# EAGLE design ccd_driver (EAGLE 8.1.0)
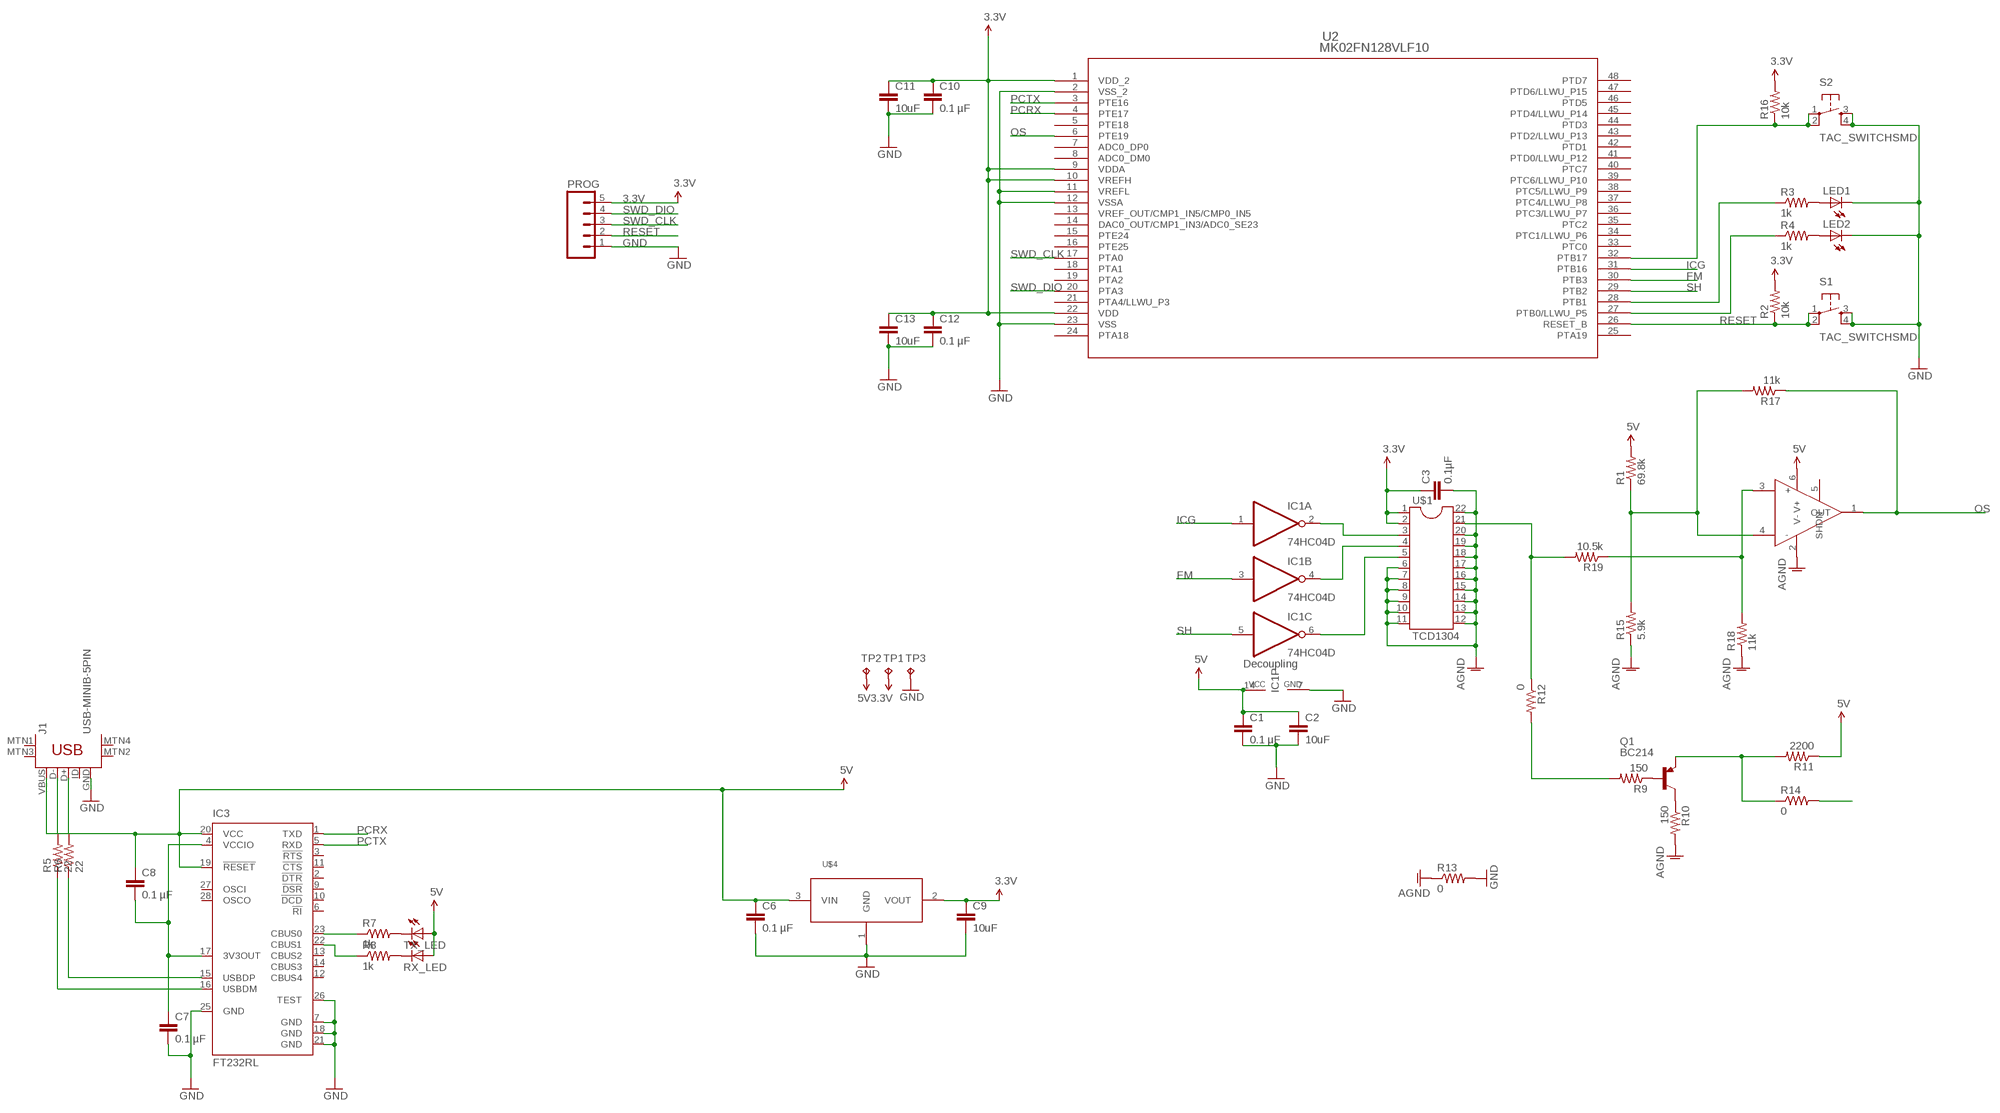
[diagram p0: schematic, sheet 1]

## Parts
C1  0.1 µF  C-EUC1206  [C1206]
C2  10uF  C-EUC1206  [C1206]
C3  0.1µF  C-EUC1206  [C1206]
C6  0.1 µF  C-EUC1206  [C1206]
C7  0.1 µF  C-EUC1206  [C1206]
C8  0.1 µF  C-EUC1206  [C1206]
C9  10uF  C-EUC1206  [C1206]
C10  0.1 µF  C-EUC1206  [C1206]
C11  10uF  C-EUC1206  [C1206]
C12  0.1 µF  C-EUC1206  [C1206]
C13  10uF  C-EUC1206  [C1206]
IC1  74HC04D  [SO14]
IC3  FT232RL  [SSOP28]
J1  USB-MINIB-5PIN  [USB-MINIB]
LED1  LEDCHIPLED_0805  [CHIPLED_0805]
LED2  LEDCHIPLED_0805  [CHIPLED_0805]
PROG  M05LOCK  [1X05_LOCK]
Q1  BC214  [TO92]
R1  69.8k  R-US_R0805  [R0805]
R2  10k  R-US_R0805  [R0805]
R3  1k  R-US_R0805  [R0805]
R4  1k  R-US_R0805  [R0805]
R5  22  R-US_R0805  [R0805]
R6  22  R-US_R0805  [R0805]
R7  1k  R-US_R0805  [R0805]
R8  1k  R-US_R0805  [R0805]
R9  150  R-US_R0805  [R0805]
R10  150  R-US_R0805  [R0805]
R11  2200  R-US_R0805  [R0805]
R12  0  R-US_R0805  [R0805]
R13  0  R-US_R0805  [R0805]
R14  0  R-US_R0805  [R0805]
R15  5.9k  R-US_R0805  [R0805]
R16  10k  R-US_R0805  [R0805]
R17  11k  R-US_R0805  [R0805]
R18  11k  R-US_R0805  [R0805]
R19  10.5k  R-US_R0805  [R0805]
RX_LED  LEDCHIPLED_0805  [CHIPLED_0805]
S1  TAC_SWITCHSMD  [TACTILE-SWITCH-SMD]
S2  TAC_SWITCHSMD  [TACTILE-SWITCH-SMD]
TP1  TPPAD1-17Y  [P1-17Y]
TP2  TPPAD1-17Y  [P1-17Y]
TP3  TPPAD1-17Y  [P1-17Y]
TX_LED  LEDCHIPLED_0805  [CHIPLED_0805]
U2  MK02FN128VLF10  [LQFP-48_7X7X1.6]
U$1  TCD1304  [TCD1304]
U$3  LTC6252  [TSOT23-6]
U$4  LD1117V33  [TO220H]

## Nets
3.3V: C3.1 C9.1 C10.1 C11.1 C12.1 C13.1 PROG.5 R2.2 R16.2 TP1.TP U2.1(VDD_2) U2.9(VDDA) U2.10(VREFH) U2.22(VDD) U$1.1 U$1.2 U$4.2(VOUT)
5V: C1.1 C2.1 C6.1 C8.1 IC1.14(P:VCC) IC3.19(!RESET) IC3.20(VCC) J1.VBUS R1.2 R11.1 RX_LED.A TP2.TP TX_LED.A U$3.6(V+) U$4.3(VIN)
AGND: C3.2 R10.2 R13.1 R15.1 R18.1 U$1.6 U$1.7 U$1.8 U$1.9 U$1.10 U$1.11 U$1.12 U$1.13 U$1.14 U$1.15 U$1.16 U$1.17 U$1.18 U$1.19 U$1.20 U$1.22 U$3.2(V-)
BU: Q1.1(E) R11.2 R14.1
FM: IC1.3(B:I) U2.30(PTB3)
GND: C1.2 C2.2 C6.2 C7.2 C9.2 C10.2 C11.2 C12.2 C13.2 IC1.7(P:GND) IC3.7(GND) IC3.18(GND) IC3.21(GND) IC3.25(GND) IC3.26(TEST) J1.GND LED1.C LED2.C PROG.1 R13.2 S1.3 S1.4 S2.3 S2.4 TP3.TP U2.2(VSS_2) U2.11(VREFL) U2.12(VSSA) U2.23(VSS) U$4.1(GND)
ICG: IC1.1(A:I) U2.31(PTB16)
N$1: R18.2 R19.1 U$3.3(+)
N$2: IC1.2(A:O) U$1.3
N$3: IC1.4(B:O) U$1.4
N$4: IC1.6(C:O) U$1.5
N$5: Q1.2(B) R9.1
N$7: R16.1 S2.1 S2.2 U2.32(PTB17)
N$8: R1.1 R15.2 R17.2 U$3.4(-)
N$9: Q1.3(C) R10.1
N$10: R12.1 R19.2 U$1.21
N$11: R3.1 U2.28(PTB1)
N$12: LED1.A R3.2
N$13: LED2.A R4.2
N$14: J1.D- R5.2
N$15: R4.1 U2.27(PTB0/LLWU_P5)
N$16: J1.D+ R6.2
N$17: C7.1 C8.2 IC3.4(VCCIO) IC3.17(3V3OUT)
N$18: IC3.23(CBUS0) R7.1
N$19: IC3.16(USBDM) R5.1
N$20: IC3.15(USBDP) R6.1
N$21: IC3.22(CBUS1) R8.1
N$22: R8.2 RX_LED.C
N$23: R7.2 TX_LED.C
N$24: R9.2 R12.2
OS: R14.2 R17.1 U2.6(PTE19) U$3.1(OUT)
PCRX: IC3.1(TXD) U2.4(PTE17)
PCTX: IC3.5(RXD) U2.3(PTE16)
RESET: PROG.2 R2.1 S1.1 S1.2 U2.26(RESET_B)
SH: IC1.5(C:I) U2.29(PTB2)
SWD_CLK [data]: PROG.3 U2.17(PTA0)
SWD_DIO [data]: PROG.4 U2.20(PTA3)
Unconnected: IC1.8(D:O) IC1.9(D:I) IC1.10(E:O) IC1.11(E:I) IC1.12(F:O) IC1.13(F:I) IC3.2(!DTR) IC3.3(!RTS) IC3.6(!RI) IC3.9(!DSR) IC3.10(!DCD) IC3.11(!CTS) IC3.12(CBUS4) IC3.13(CBUS2) IC3.14(CBUS3) IC3.27(OSCI) IC3.28(OSCO) J1.ID J1.MTN1(MTN2) J1.MTN2(MTN3) J1.MTN3(MTN1) J1.MTN4 U2.5(PTE18) U2.7(ADC0_DP0) U2.8(ADC0_DM0) U2.13(VREF_OUT/CMP1_IN5/CMP0_IN5) U2.14(DAC0_OUT/CMP1_IN3/ADC0_SE23) U2.15(PTE24) U2.16(PTE25) U2.18(PTA1) U2.19(PTA2) U2.21(PTA4/LLWU_P3) U2.24(PTA18) U2.25(PTA19) U2.33(PTC0) U2.34(PTC1/LLWU_P6) U2.35(PTC2) U2.36(PTC3/LLWU_P7) U2.37(PTC4/LLWU_P8) U2.38(PTC5/LLWU_P9) U2.39(PTC6/LLWU_P10) U2.40(PTC7) U2.41(PTD0/LLWU_P12) U2.42(PTD1) U2.43(PTD2/LLWU_P13) U2.44(PTD3) U2.45(PTD4/LLWU_P14) U2.46(PTD5) U2.47(PTD6/LLWU_P15) U2.48(PTD7) U$3.5(SHDN)

## Notes on the sheet
- Decoupling

## Library data of the parts
C1-C3 C6-C13 = resistor:C-EU: CAPACITOR, European symbol
IC1 = 74xx-eu:74*04: Hex INVERTER
IC3 = ftdichip:FT232R: Source: http://www.ftdichip.com/Documents/DataSheets/DS_FT232R_v104.pdf; MPN: FT232RL; OC_FARNELL: 1146032; OC_NEWARK: 91K9918
J1 = SparkFun-Connectors:USB-MINIB: Mini-USB "B" connector with 5th pin broken out. Created new symbol breaking out 5th "ID" pin in mini/micro USB connector spec. See: http://en.wikipedia.org/wiki/Mini_usb#Cables. Uses same footprint as 4-pin symbol. Also added pins to connect to mounting / shield pads if required (probably not generally needed as signals aren't shielded once they leave the connector).; PROD_ID: CONN-08193
LED1 LED2 RX_LED TX_LED = led:LED: LED OSRAM: - CHIPLED LG R971, LG N971, LY N971, LG Q971, LY Q971, LO R971, LY R971 LH N974, LH R974 LS Q976, LO Q976, LY Q976 LO Q996 - Hyper CHIPLED LW Q18S LB Q993, LB Q99A, LB R99A - SideLED LS A670, LO A670, LY A670, LG A670, LP A670 LB A673, LV A673, LT A673, LW A673 LH A674 LY A675 LS A676, LA A676, LO A676, LY A676, LW A676 LS A679, LY A679, LG A679 - Hyper Micro SIDELED® LS Y876, LA Y876, LO Y876, LY Y876 LT Y87S - SmartLED LW L88C, LW L88S LB L89C, LB L89S, LG L890 LS L89K, LO L89K, LY L89K LS L896, LA L896, LO L896, LY L896 - TOPLED LS T670, LO T670, LY T670, LG T670, LP T670 LSG T670, LSP T670, LSY T670, LOP T670, LYG T670 LG T671, LOG T671, LSG T671 LB T673, LV T673, LT T673, LW T673 LH T674 LS T676, LA T676, LO T676, LY T676, LB T676, LH T676, LSB T676, LW T676 LB T67C, LV T67C, LT T67C, LS T67K, LO T67K, LY T67K, LW E67C LS E67B, LA E67B, LO E67B, LY E67B, LB E67C, LV E67C, LT E67C LW T67C LS T679, LY T679, LG T679 LS T770, LO T770, LY T770, LG T770, LP T770 LB T773, LV T773, LT T773, LW T773 LH T774 LS E675, LA E675, LY E675, LS T675 LS T776, LA T776, LO T776, LY T776, LB T776 LHGB T686 LT T68C, LB T68C - Hyper Mini TOPLED® LB M676 - Mini TOPLED Santana® LG M470 LS M47K, LO M47K, LY M47K Source: http://www.osram.convergy.de LUXEON: - LUMILED® LXK2-PW12-R00, LXK2-PW12-S00, LXK2-PW14-U00, LXK2-PW14-V00 LXK2-PM12-R00, LXK2-PM12-S00, LXK2-PM14-U00 LXK2-PE12-Q00, LXK2-PE12-R00, LXK2-PE12-S00, LXK2-PE14-T00, LXK2-PE14-U00 LXK2-PB12-K00, LXK2-PB12-L00, LXK2-PB12-M00, LXK2-PB14-N00, LXK2-PB14-P00, LXK2-PB14-Q00 LXK2-PR12-L00, LXK2-PR12-M00, LXK2-PR14-Q00, LXK2-PR14-R00 LXK2-PD12-Q00, LXK2-PD12-R00, LXK2-PD12-S00 LXK2-PH12-R00, LXK2-PH12-S00 LXK2-PL12-P00, LXK2-PL12-Q00, LXK2-PL12-R00 Source: www.luxeon.com KINGBRIGHT: KA-3528ASYC Source: www.kingbright.com
PROG = SparkFun-Connectors:M05: Header 5 Standard 5-pin 0.1" header. Use with straight break away headers (SKU : PRT-00116), right angle break away headers (PRT-00553), swiss pins (PRT-00743), machine pins (PRT-00117), and female headers (PRT-00115). Molex polarized connector foot print use with SKU : PRT-08230 with associated crimp pins and housings.
Q1 = transistor-pnp:BC214: PNP Transistor
R1-R19 = resistor:R-US_: RESISTOR, American symbol
S1 S2 = SparkFun-Retired:TAC_SWITCH: Momentary Switch Button commonly used for reset or general input. Spark Fun Electronics SKU : COM-00097 SMT- SWCH-08247; PROD_ID: SWCH-08247
TP1-TP3 = testpad:TP: Test pad
U2 = MK02FN128VLF10:MK02FN128VLF10; CPU: ARM Cortex-M4F; FLASHKB: 128; MANUFACTURER_PART_NUMBER: mk02fn128vlf10; MAXFREQUENCY: 100; PINCOUNT: 48; SRAMKB: 16; VENDOR: FREESCALE
U$1 = ccd:TCD1304
U$3 = ccd:LTC6252
U$4 = ccd:LD1117V33

## Net classes
1 data: width 0.152 mm
2 power: width 0.508 mm, drill 0.305 mm, clearance 0.203 mm
3 power2: width 0.254 mm

## Board
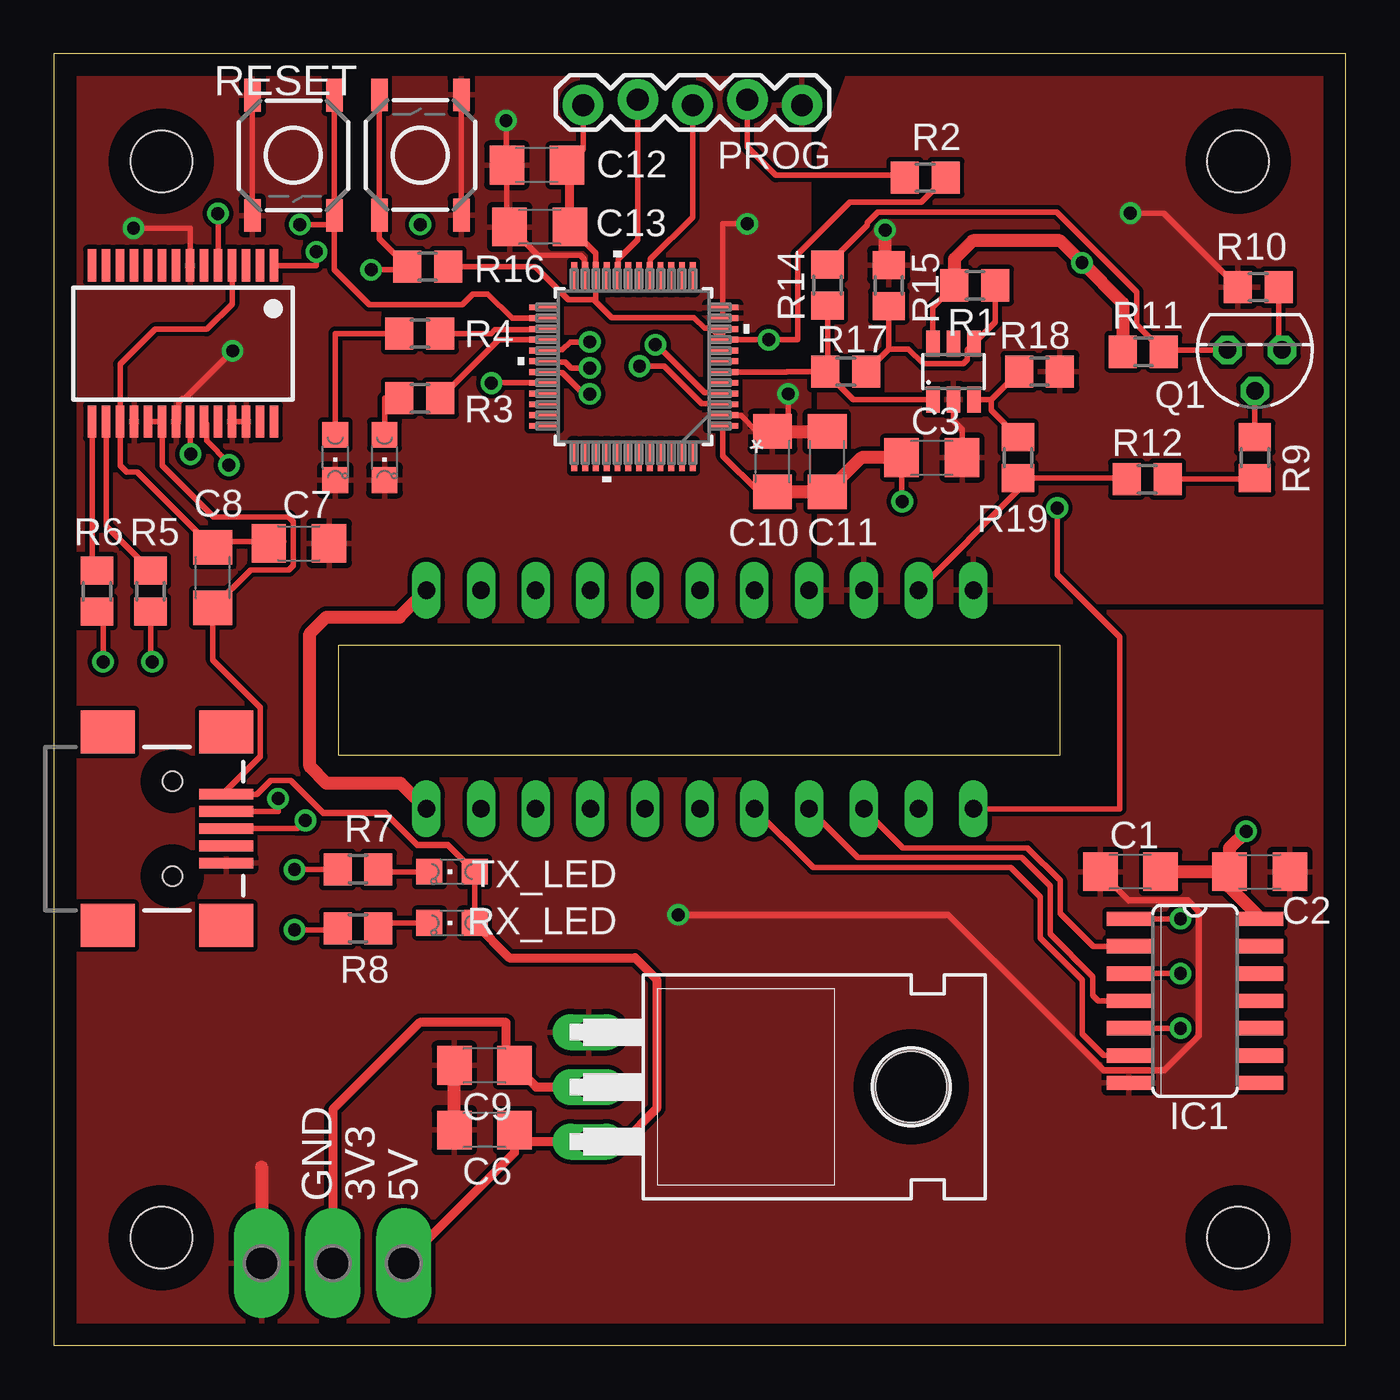
[diagram p1: board, top side]
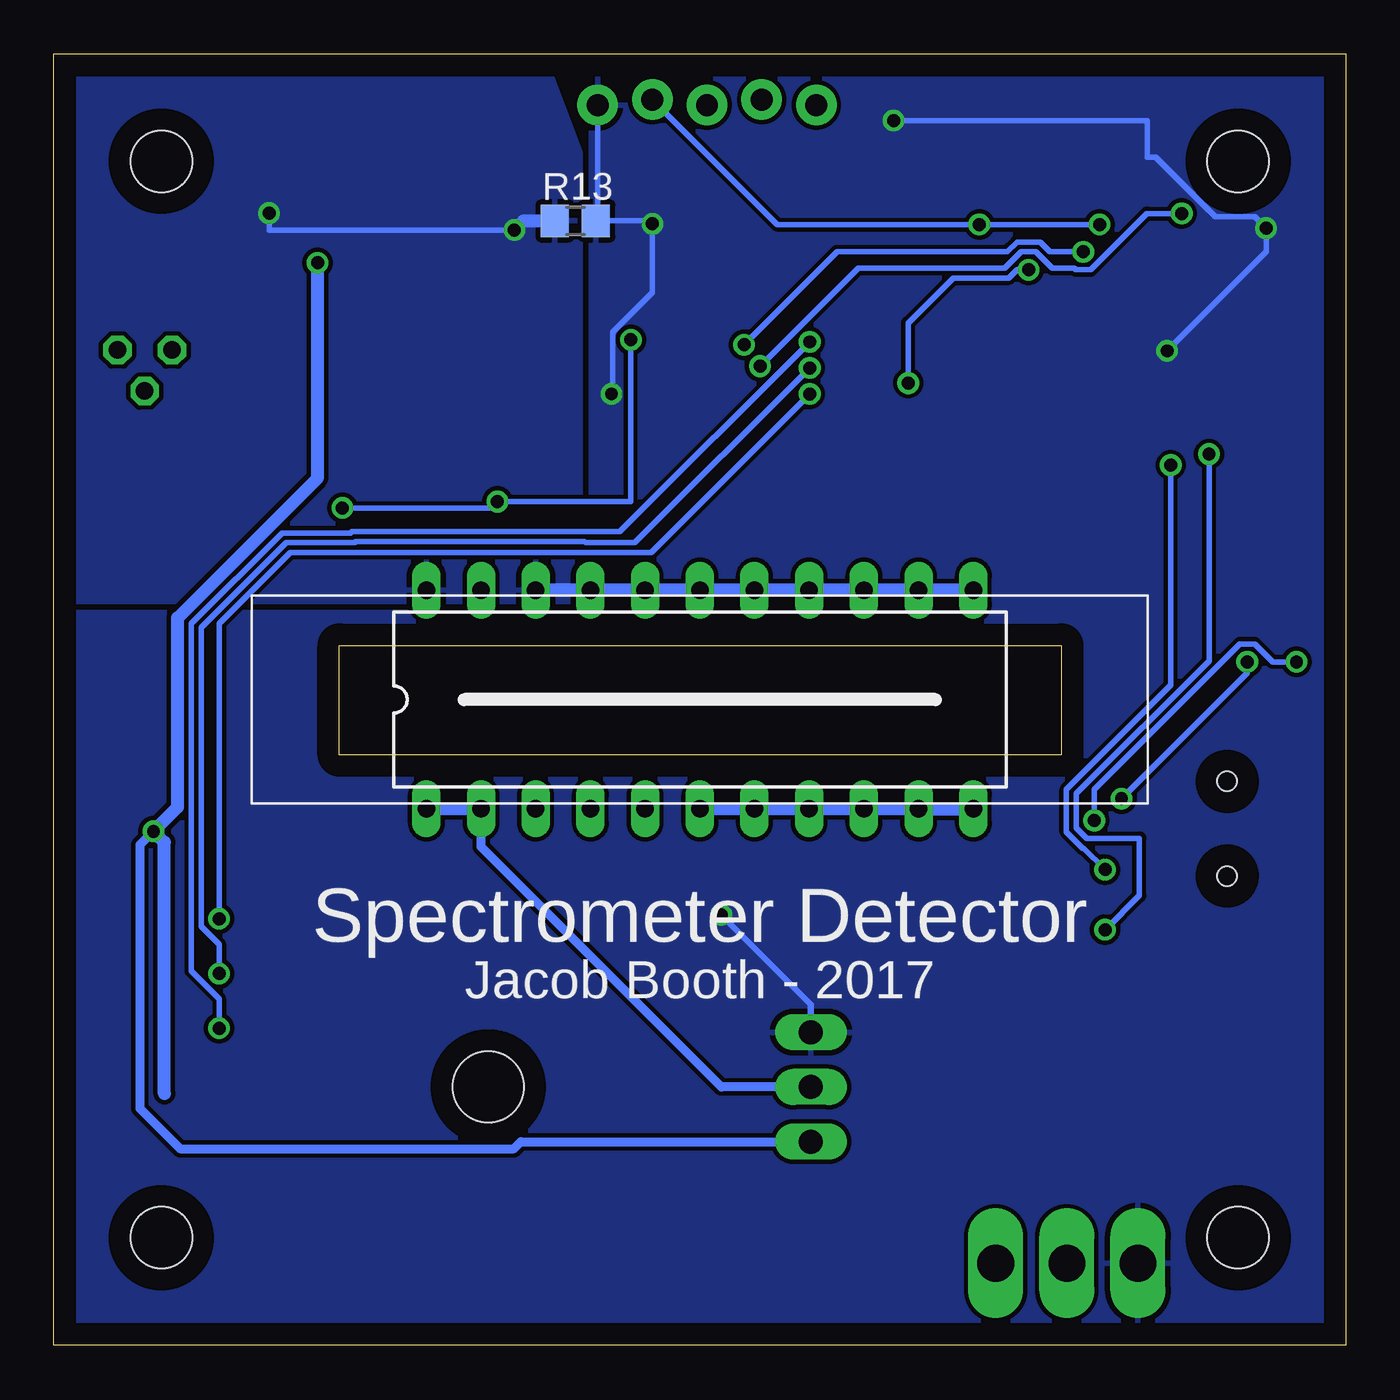
[diagram p2: board, bottom side, seen from below]

Size 60 x 60 mm. Coordinates in mm from the lower left corner, seen from the top.
Outline: 0,0 60,0 60,60 0,60 0,0
Outline: 13.21,32.51 13.21,27.43 46.74,27.43 46.74,32.51 13.21,32.51
Copper layers (1*16): Top 0.035mm / dielectric 1.5mm / Bottom 0.035mm
Design rules "default": minimum track width 10mil, minimum drill 24mil, track to track 8mil, track to pad 8mil, pad to pad 8mil, via to via 8mil, smd to smd 8mil, copper to edge 40mil, drill to drill 8mil, minimum pad ring 10mil, minimum via ring 8mil, stop-mask expansion 4mil, vias tented up to drill 0mil, thermal gap 10mil
Holes 2.84 mm at 5,55 55,55 55,5 5,5
tKeepout: area 2.2,52.2 to 7.8,57.8; area 52.2,52.2 to 57.8,57.8; area 52.2,2.2 to 57.8,7.8; area 2.2,2.2 to 7.8,7.8

### Footprints (pad centres in the part's own frame; a part is rotated, then mirrored left to right if it is on the bottom)
C1206 = smd 1.6 x 1.8: 1 -1.4,0; 2 1.4,0
SO14 = smd 0.66 x 2.032: 1 -3.81,-3.073; 2 -2.54,-3.073; 3 -1.27,-3.073; 4 0,-3.073; 5 1.27,-3.073; 6 2.54,-3.073; 7 3.81,-3.073; 8 3.81,3.073; 9 2.54,3.073; 10 1.27,3.073; 11 0,3.073; 12 -1.27,3.073; 13 -2.54,3.073; 14 -3.81,3.073
SSOP28 = smd 0.4 x 1.5: 1 -4.225,-3.625; 2 -3.575,-3.625; 3 -2.925,-3.625; 4 -2.275,-3.625; 5 -1.625,-3.625; 6 -0.975,-3.625; 7 -0.325,-3.625; 8 0.325,-3.625; 9 0.975,-3.625; 10 1.625,-3.625; 11 2.275,-3.625; 12 2.925,-3.625; 13 3.575,-3.625; 14 4.225,-3.625; 15 4.225,3.625; 16 3.575,3.625; 17 2.925,3.625; 18 2.275,3.625; 19 1.625,3.625; 20 0.975,3.625; 21 0.325,3.625; 22 -0.325,3.625; 23 -0.975,3.625; 24 -1.625,3.625; 25 -2.275,3.625; 26 -2.925,3.625; 27 -3.575,3.625; 28 -4.225,3.625
USB-MINIB = smd 2.5 x 0.5: D+ 2.5,0; D- 2.5,0.8; GND 2.5,-1.6; ID 2.5,-0.8; VBUS 2.5,1.6 | smd 2.5 x 2: MTN1 -3,4.5; MTN2 2.5,4.5; MTN3 -3,-4.5; MTN4 2.5,-4.5 | hole 0.9: 0,2.2; 0,-2.2
CHIPLED_0805 = smd 1.2 x 1.2: A 0,-1.05; C 0,1.05
1X05_LOCK = drill 1.016 pad 1.88: 1 0,0.127; 2 2.54,-0.127; 3 5.08,0.127; 4 7.62,-0.127; 5 10.16,0.127
TO92 = drill 0.813 octagon: 1 1.27,0; 2 0,1.905; 3 -1.27,0
R0805 = smd 1.3 x 1.5: 1 -0.95,0; 2 0.95,0
TACTILE-SWITCH-SMD = smd 1.524 x 0.762: 1 -2.794,1.905; 2 2.794,1.905; 3 -2.794,-1.905; 4 2.794,-1.905
P1-17Y = drill 1.702 pad 2.121 long: TP 0,0
LQFP-48_7X7X1.6 = smd 1.411 x 0.27: 1 -4.15,2.75; 2 -4.15,2.25; 3 -4.15,1.75; 4 -4.15,1.25; 5 -4.15,0.75; 6 -4.15,0.25; 7 -4.15,-0.25; 8 -4.15,-0.75; 9 -4.15,-1.25; 10 -4.15,-1.75; 11 -4.15,-2.25; 12 -4.15,-2.75; 25 4.15,-2.75; 26 4.15,-2.25; 27 4.15,-1.75; 28 4.15,-1.25; 29 4.15,-0.75; 30 4.15,-0.25; 31 4.15,0.25; 32 4.15,0.75; 33 4.15,1.25; 34 4.15,1.75; 35 4.15,2.25; 36 4.15,2.75 | smd 0.27 x 1.411: 13 -2.75,-4.15; 14 -2.25,-4.15; 15 -1.75,-4.15; 16 -1.25,-4.15; 17 -0.75,-4.15; 18 -0.25,-4.15; 19 0.25,-4.15; 20 0.75,-4.15; 21 1.25,-4.15; 22 1.75,-4.15; 23 2.25,-4.15; 24 2.75,-4.15; 37 2.75,4.15; 38 2.25,4.15; 39 1.75,4.15; 40 1.25,4.15; 41 0.75,4.15; 42 0.25,4.15; 43 -0.25,4.15; 44 -0.75,4.15; 45 -1.25,4.15; 46 -1.75,4.15; 47 -2.25,4.15; 48 -2.75,4.15
TCD1304 = drill 0.813 long: 1 -12.7,-5.08; 2 -10.16,-5.08; 3 -7.62,-5.08; 4 -5.08,-5.08; 5 -2.54,-5.08; 6 0,-5.08; 7 2.54,-5.08; 8 5.08,-5.08; 9 7.62,-5.08; 10 10.16,-5.08; 11 12.7,-5.08; 12 12.7,5.08; 13 10.16,5.08; 14 7.62,5.08; 15 5.08,5.08; 16 2.54,5.08; 17 0,5.08; 18 -2.54,5.08; 19 -5.08,5.08; 20 -7.62,5.08; 21 -10.16,5.08; 22 -12.7,5.08
TSOT23-6 = smd 0.62 x 1.22: 1 -0.95,-1.3; 2 0,-1.3; 3 0.95,-1.3; 4 0.95,1.3; 5 0,1.3; 6 -0.95,1.3
TO220H = drill 1.118 long: 1 -2.54,-10.16; 2 0,-10.16; 3 2.54,-10.16 | hole 3.302: 0,4.826

### Placement (x,y rotation side)
C1  50,22 180 top
C2  56,22 0 top
C3  40.78,41.24 0 top
C6  20,10 180 top
C7  11.38,37.25 0 top
C8  7.38,35.67 90 top
C9  20,13 180 top
C10  33.38,41.05 90 top
C11  35.92,41.05 90 top
C12  22.44,54.83 180 top
C13  22.57,51.96 180 top
IC1  53,16 270 top
IC3  6,46.54 180 top
J1  5.51,24 0 top
LED1  15.36,41.25 180 top
LED2  13.07,41.25 180 top
PROG  34.75,57.75 180 top
Q1  55.78,46.24 180 top
R1  42.78,49.24 180 top
R2  40.47,54.24 0 top
R3  17,44 180 top
R4  17,47 180 top
R5  4.49,35.03 270 top
R6  2,35.03 270 top
R7  14.13,22.11 0 top
R8  14.13,19.36 0 top
R9  55.78,41.24 270 top
R10  55.93,49.16 180 top
R11  50.6,46.16 0 top
R12  50.78,40.24 0 top
R13  35.78,52.24 0 bottom
R14  35.93,49.26 270 top
R15  38.78,49.24 270 top
R16  17.36,50.11 0 top
R17  36.78,45.24 0 top
R18  45.78,45.24 180 top
R19  44.78,41.24 270 top
RX_LED  18.49,19.62 90 top
S1  11.13,55.28 270 top
S2  17.02,55.3 90 top
TP1  12.95,3.81 0 top
TP2  16.26,3.81 0 top
TP3  9.65,3.81 0 top
TX_LED  18.49,22 90 top
U2  26.92,45.47 180 top
U$1  30,30 0 bottom
U$3  41.78,45.24 0 top
U$4  35,12 270 top

### Tracks (layer width: path | path; a pad name or v marks a point on that pad's centre or on a via)
3.3V  (via drill 0.6)
  Top 0.254: U2.10 U2.9 | C12.1 24.59,55.58 PROG.5 | C13.1 25.17,50.75 U2.22 25.17,48.49 | U2.1 31.07,41.32 32.74,39.65 C10.1 | R2.2 40.29,53.11 36.97,53.11 34.54,50.68 34.54,46.74 34.52,46.72 v33.2,46.72 U2.9 | U2.9 30.54,47.25 30.23,47.25 29.73,47.75 25.91,47.75 25.17,48.49 | 25.17,48.49 25.08,48.58 23.9,48.58 22.37,50.11 R16.2 | U$1.1 49.5,24.92 49.5,32.9 46.6,35.8 v46.6,38.9 | v39.4,39.2 39.38,39.2 C3.1
  Top 0.406: C12.1 23.96,54.7 C13.1 | U$4.2 22.4,12 C9.1 21,13.4 21,15 17,15 12.95,10.95 TP1.TP
  Top 0.61: C10.1 C11.1 37.5,41.24 C3.1
  Bottom 0.254: v46.6,38.9 39.4,38.9 v39.4,39.2 33.2,39.2 v33.2,46.72
  Bottom 0.406: U$4.2 29,12 40.16,23.16 U$1.2
  Bottom 0.61: U$1.2 U$1.1
5V  (via drill 0.6)
  Top 0.254: R1.2 40.83,48.24 U$3.6 | RX_LED.A TX_LED.A | IC3.19 IC3.20 5.03,40.88 7.42,38.48 10.92,38.48 11.12,38.28 11.12,36.23 10.92,36.02 9.14,36.02 C8.1 7.38,31.84 9.59,29.64 9.59,27.36 8.01,25.78 J1.VBUS 9.44,25.6 10.07,26.23 11.01,26.23 12.52,24.73
  Top 0.305: TX_LED.A 18.3,23.24 16.88,23.24 15.39,24.73 13,24.73 | 13,24.73 12.54,24.73 | 12.52,24.73 13,24.73
  Top 0.406: TP2.TP 21.4,8.95 C6.1 21.94,9.46 U$4.3 26.46,9.46 28,11 28,17 27,18 21.16,18 RX_LED.A
  Top 0.61: IC1.14 54.6,21.28 C2.1 | C2.1 C1.1 | v55.37,23.88 54.6,23.1 C2.1 | R11.1 49.65,48.39 v47.75,50.29 46.74,51.31 42.67,51.31 41.83,50.46 R1.2
  Bottom 0.406: v55.37,23.88 56,23.25 56,11 54.13,9.13 38.64,9.13 38.31,9.46 U$4.3
  Bottom 0.61: 54.86,11.68 54.86,23.37 v55.37,23.88 54.25,25 54.25,33.79 47.75,40.29 v47.75,50.29
AGND  (via drill 0.6)
  Top 0.254: U$3.2 41.78,42.93 42.18,42.53 C3.2 | v50,52.6 51.54,52.6 R10.2
  Top 0.61: R15.1 38.61,50.36 v38.61,51.82 | U$1.11 16.11,26.11 12.66,26.11 11.89,26.89 11.89,33.06 12.66,33.83 16.05,33.83 U$1.12
  Bottom 0.254: v38.61,51.82 50,51.82 v50,52.6
  Bottom 0.61: v38.61,51.82 38.19,52.24 R13.1 | U$1.12 U$1.13 U$1.14 U$1.15 U$1.16 U$1.17 U$1.18 U$1.19 U$1.20 | U$1.11 U$1.10 U$1.9 U$1.8 U$1.7 U$1.6
  pour Top: 35.56,55.37 37.08,59.44 59.44,59.44 59.44,34.54 35.56,34.54
  pour Bottom: 35.56,55.37 37.08,59.44 59.44,59.44 59.44,34.54 35.56,34.54
BU
  Top 0.254: Q1.1 51.63,46.24 R11.2 50.28,47.42 50.28,48.94 46.57,52.65 38.26,52.65 37.77,52.16 37.77,52.05 R14.1
FM  (via drill 0.6)
  Top 0.254: U2.30 22.81,45.68 23.76,45.68 24.04,45.41 v24.89,45.41 | v52.32,17.27 IC1.3
  Bottom 0.254: v24.89,45.41 33.01,37.29 35.31,37.29 35.36,37.34 45.97,37.34 46.02,37.29 49.21,37.29 53.16,33.34 53.16,19.47 52.32,18.63 v52.32,17.27
GND  (via drill 0.6)
  Top 0.254: C13.2 21.04,52.08 C12.2 21,54.83 v21,56.9 | 20.87,52.25 C13.2 | IC3.26 IC3.25 | IC3.18 3.73,43.05 | 5.67,43.05 IC3.21 5.79,43.03 5.79,43.8 5.99,43.99 6.09,43.99 v8.3,46.2 | S1.4 S1.3 | S2.4 S2.3 | U2.23 24.64,49.65 24.64,50.46 24.45,50.65 22.47,50.65 C13.2 | U2.11 U2.12 31.07,52.1 v32.2,52.1 | U2.2 31.11,43.18 31.92,43.18 32.64,42.45 C10.2 34.1,42.45 v34.1,44.2 | v3.7,51.9 6.33,51.9 IC3.7
  Top 0.305: v29,20 41.54,20 48.76,12.77 51.58,12.77 53.18,14.38 53.18,20.17 52.68,20.67 49.93,20.67 C1.2
  Top 0.61: C10.2 C11.2 | 9.65,8.29 TP3.TP | C6.2 C9.2
  Bottom 0.254: v8.3,46.2 3.7,50.8 v3.7,51.9 4.24,52.44 6.06,52.44 8.83,55.2 9.22,55.2 9.22,56.9 v21,56.9 | R13.2 34.75,52.24 | 34.75,52.24 PROG.1 | 34.75,52.24 32.2,52.24 v32.2,52.1 32.2,48.9 34.03,47.06 34.03,44.27 v34.1,44.2
  Bottom 0.305: v29,20 24.84,15.84 U$4.1
  pour Top: 1.02,58.93 35.05,58.93 35.05,34.04 58.93,34.04 58.93,1.02 1.02,1.02
  pour Bottom: 1.02,58.93 35.05,58.93 35.05,34.04 58.93,34.04 58.93,1.02 1.02,1.02
ICG  (via drill 0.6)
  Top 0.254: U2.31 22.81,45.18 23.62,45.18 24.6,44.2 v24.89,44.2 | v52.32,19.81 IC1.1
  Bottom 0.254: v24.89,44.2 32.26,36.83 49.02,36.83 52.32,33.53 v52.32,19.81
N$1
  Top 0.254: 43.53,43.94 R18.2 | 43.53,43.94 U$3.3 | R19.1 43.53,43.44 43.53,43.94
N$2
  Top 0.254: U$1.3 39.43,23.11 45.21,23.11 46.74,21.59 46.74,20.07 48.26,18.54 IC1.2
N$3
  Top 0.254: U$1.4 37.34,22.66 44.96,22.66 46.28,21.34 46.28,19.11 48.26,17.12 48.26,16.26 48.52,16 IC1.4
N$4
  Top 0.254: U$1.5 35.26,22.2 44.45,22.2 45.82,20.83 45.82,18.91 47.75,16.98 47.75,14.48 48.77,13.46 IC1.6
N$5
  Top 0.254: Q1.2 R9.1
N$7  (via drill 0.6)
  Top 0.254: S2.2 S2.1 15.12,51.41 R16.1 16.26,49.97 v14.73,49.97 | v20.32,44.7 20.33,44.72 U2.32
  Bottom 0.254: v20.32,44.7 20.32,47.5 18.24,49.58 15.65,49.58 15.26,49.97 v14.73,49.97
N$8
  Top 0.254: 38.78,46.29 R17.2 | 38.78,46.29 R15.2 | R1.1 43.73,47.54 U$3.4 42.42,46.23 42.42,45.79 42.23,45.6 40.38,45.6 39.69,46.29 38.78,46.29
N$9
  Top 0.254: Q1.3 56.88,46.4 R10.1
N$10
  Top 0.254: R12.1 49.78,40.29 R19.2 44.78,39.7 U$1.21
N$11
  Top 0.254: R3.1 20.67,46.72 U2.28
N$12
  Top 0.254: LED1.A 15.36,44 R3.2
N$13
  Top 0.254: R4.2 13.07,47 LED2.A
N$14  (via drill 0.6)
  Top 0.254: J1.D- 10.41,24.8 v10.41,25.4 | v4.57,31.75 4.49,31.75 R5.2
  Bottom 0.254: v10.41,25.4 4.57,31.24 v4.57,31.75
N$15
  Top 0.254: U2.27 22.74,47.18 20.48,47.18 20.3,47 R4.1
N$16  (via drill 0.6)
  Top 0.254: R6.2 2.29,34.08 v2.29,31.75 | v11.68,24.38 11.3,24 J1.D+
  Bottom 0.254: v2.29,31.75 3.39,31.75 4.23,32.58 4.92,32.58 11.68,25.82 v11.68,24.38
N$17
  Top 0.254: IC3.4 8.28,48.38 7.1,47.2 4.7,47.2 3.08,45.58 IC3.17 3.08,40.88 3.39,40.56 3.88,40.56 C8.2 7.65,37.34 10.67,37.34 9.98,37.34 C7.1
N$18  (via drill 0.6)
  Top 0.254: v11.18,22.1 11.19,22.11 R7.1 | IC3.23 7.09,42.8 7.09,42.03 8.13,40.99 v8.13,40.89
  Bottom 0.254: v11.18,22.1 12.17,23.09 12.22,23.09 12.97,23.85 12.97,25.82 8.13,30.67 v8.13,40.89
N$19
  Top 0.254: R5.1 2.42,38.05 IC3.16
N$20
  Top 0.254: R6.1 1.77,36.21 IC3.15
N$21  (via drill 0.6)
  Top 0.254: R8.1 13.12,19.3 v11.18,19.3 | v6.35,41.4 6.33,41.43 IC3.22
  Bottom 0.254: v11.18,19.3 9.58,20.9 9.58,23.55 12.03,23.55 12.52,24.04 12.52,25.63 6.35,31.8 v6.35,41.4
N$22
  Top 0.254: RX_LED.C 15.08,19.62 R8.2
N$23
  Top 0.254: TX_LED.C 15.08,22 R7.2
N$24
  Top 0.254: R9.2 55.73,40.24 R12.2
OS
  Top 0.254: U$3.1 37.13,43.94 R17.1 | R17.1 35.93,45.34 R14.2 | U2.6 34.04,45.21 34.06,45.24 R17.1
PCRX  (via drill 0.6)
  Top 0.254: U2.4 31.04,44.25 30.23,44.25 28,46.48 v27.94,46.48 | IC3.1 12.19,50.16 v12.19,50.8
  Bottom 0.254: v27.94,46.48 23.62,50.8 15.72,50.8 15.27,51.26 14.2,51.26 13.74,50.8 v12.19,50.8
PCTX  (via drill 0.6)
  Top 0.254: U2.3 31.04,43.75 30.09,43.75 28.35,45.49 v27.2,45.49 | v7.62,52.58 v7.62,52.57 IC3.5
  Bottom 0.254: v27.2,45.49 22.65,50.04 15.84,50.04 15.08,50.8 14.39,50.8 13.62,50.04 12.61,50.04 12.54,49.97 11.85,49.97 9.23,52.58 v7.62,52.58
RESET  (via drill 0.6)
  Top 0.254: S1.2 S1.1 | v11.43,52.07 13.03,52.07 S1.2 | R2.1 39.41,54.36 33.53,54.36 32.21,55.68 PROG.2 | U2.26 21.28,47.72 20.16,48.84 19.47,48.84 18.98,48.35 14.64,48.35 13.03,49.96 S1.2
  Bottom 0.254: v11.43,52.07 v17.02,52.07 26.4,52.07 PROG.2
SH  (via drill 0.6)
  Top 0.254: U2.29 22.81,46.25 23.62,46.25 23.98,46.62 v24.89,46.62 | v52.32,14.73 IC1.5
  Bottom 0.254: v24.89,46.62 33.71,37.8 46.16,37.8 46.21,37.74 49.4,37.74 53.62,33.53 53.62,17.38 52.32,16.09 v52.32,14.73
SWD_CLK
  Top 0.254: U2.17 27.71,49.65 27.71,50.46 29.67,52.42 PROG.3
SWD_DIO
  Top 0.254: U2.20 26.21,49.65 26.21,50.46 27.13,51.38 PROG.4

### Text on the board
tNames: RESET | GND | 3V3 | 5V
bNames: Spectrometer Detector | Jacob Booth - 2017